# EAGLE design rs422 (EAGLE 9.5.1)
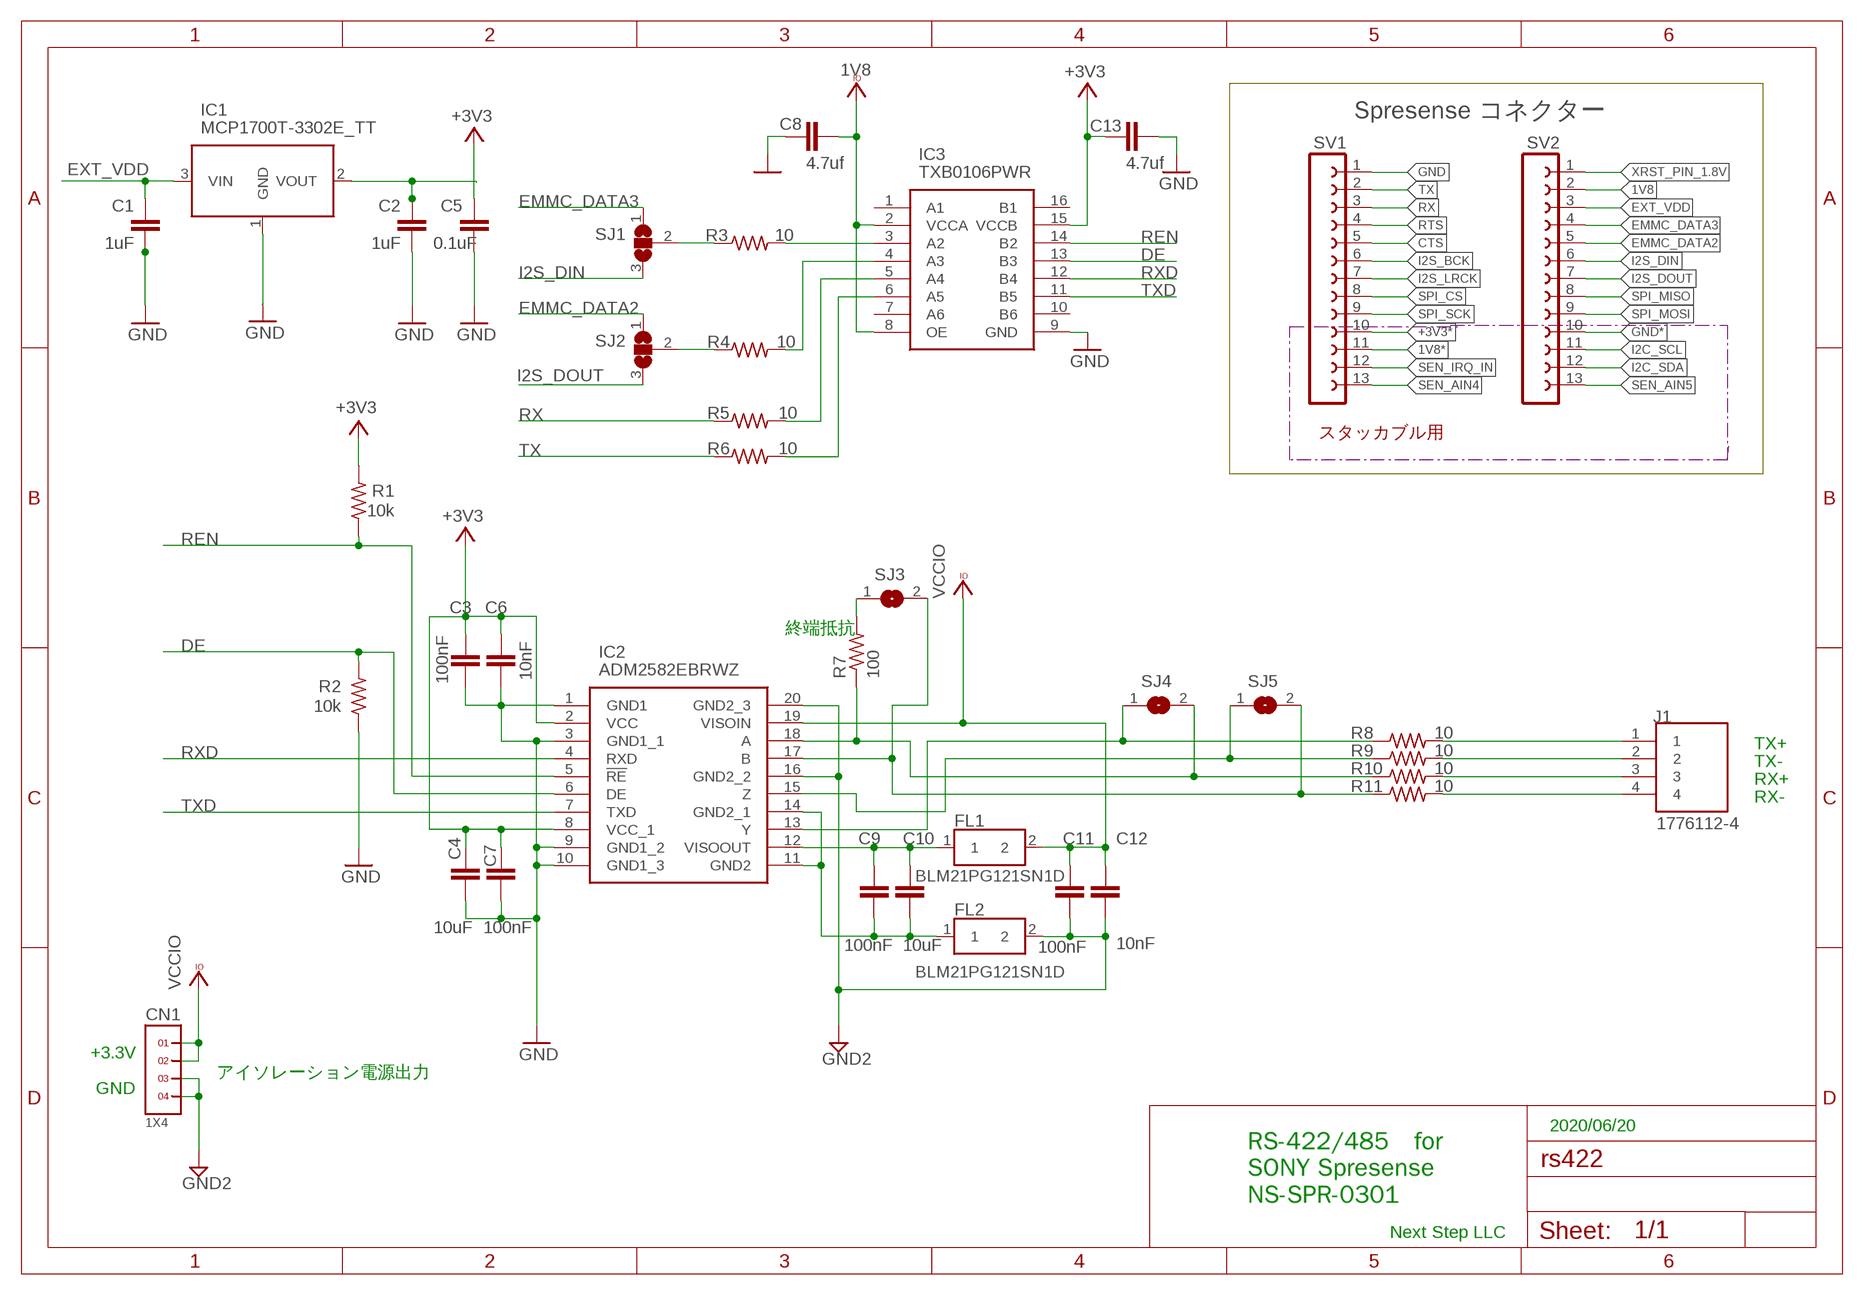
[diagram p0: schematic, sheet 1]

## Parts
C1  1uF  C-EUC0603K  [C0603K]
C2  1uF  C-EUC0603K  [C0603K]
C3  100nF  C-EUC0603K  [C0603K]
C4  10uF  C-EUC0603K  [C0603K]
C5  0.1uF  C-EUC0603K  [C0603K]
C6  10nF  C-EUC0603K  [C0603K]
C7  100nF  C-EUC0603K  [C0603K]
C8  4.7uf  C-EUC0603K  [C0603K]
C9  100nF  C-EUC0603K  [C0603K]
C10  10uF  C-EUC0603K  [C0603K]
C11  100nF  C-EUC0603K  [C0603K]
C12  10nF  C-EUC0603K  [C0603K]
C13  4.7uf  C-EUC0603K  [C0603K]
CN1  1X4  [1X4]
FL1  BLM21PG121SN1D  [BEADC2012X105N]
FL2  BLM21PG121SN1D  [BEADC2012X105N]
IC1  MCP1700T-3302E_TT  [SOT95P237X112-3N]
IC2  ADM2582EBRWZ  [SOIC127P1032X265-20N]
IC3  TXB0106PWR  [SOP65P640X120-16N]
J1  1776112-4  [TE_1776112-4]
R1  10k  R-US_R0603  [R0603]
R2  10k  R-US_R0603  [R0603]
R3  10  R-US_R0603  [R0603]
R4  10  R-US_R0603  [R0603]
R5  10  R-US_R0603  [R0603]
R6  10  R-US_R0603  [R0603]
R7  100  R-US_R0603  [R0603]
R8  10  R-US_R0603  [R0603]
R9  10  R-US_R0603  [R0603]
R10  10  R-US_R0603  [R0603]
R11  10  R-US_R0603  [R0603]
SJ1  SJ2W  [SJ_2]
SJ2  SJ2W  [SJ_2]
SJ3  SJ  [SJ]
SJ4  SJ  [SJ]
SJ5  SJ  [SJ]
SV1  FE13-1  [FE13]
SV2  FE13-1  [FE13]

## Nets
1V8: C8.2 IC3.2(VCCA) IC3.8(OE) SV2.2
1V8*: SV1.11
+3V3: C2.1 C3.1 C4.1 C5.1 C6.1 C7.1 C13.1 IC1.2(VOUT) IC2.2(VCC) IC2.8(VCC_1) IC3.15(VCCB) R1.2
+3V3*: SV1.10
CTS: SV1.5
DE: IC2.6(DE) IC3.13(B3) R2.2
EMMC_DATA2: SJ2.1 SV2.5
EMMC_DATA3: SJ1.1 SV2.4
EXT_VDD: C1.1 IC1.3(VIN) SV2.3
GND: C1.2 C2.2 C3.2 C4.2 C5.2 C6.2 C7.2 C8.1 C13.2 IC1.1(GND) IC2.1(GND1) IC2.3(GND1_1) IC2.9(GND1_2) IC2.10(GND1_3) IC3.9(GND) R2.1 SV1.1
GND2: C11.2 C12.2 CN1.3 CN1.4 FL2.2 IC2.16(GND2_2) IC2.20(GND2_3)
GND*: SV2.10
I2C_SCL: SV2.11
I2C_SDA: SV2.12
I2S_BCK: SV1.6
I2S_DIN: SJ1.3 SV2.6
I2S_DOUT: SJ2.3 SV2.7
I2S_LRCK: SV1.7
N$1: IC2.13(Y) R8.1 SJ4.1
N$2: IC2.15(Z) R9.1 SJ5.1
N$3: IC2.18(A) R7.1 R10.1 SJ4.2
N$4: IC2.17(B) R11.1 SJ3.2 SJ5.2
N$5: C9.1 C10.1 FL1.1 IC2.12(VISOOUT)
N$6: R3.1 SJ1.2
N$7: R7.2 SJ3.1
N$8: IC3.3(A2) R3.2
N$9: IC3.4(A3) R4.2
N$10: IC3.5(A4) R5.2
N$11: C9.2 C10.2 FL2.1 IC2.11(GND2) IC2.14(GND2_1)
N$12: IC3.6(A5) R6.2
N$13: R4.1 SJ2.2
N$27: J1.1 R8.2
N$28: J1.2 R9.2
N$29: J1.3 R10.2
N$30: J1.4 R11.2
REN: IC2.5(!RE) IC3.14(B2) R1.1
RTS: SV1.4
RX: R5.1 SV1.3
RXD: IC2.4(RXD) IC3.12(B4)
SEN_AIN4: SV1.13
SEN_AIN5: SV2.13
SEN_IRQ_IN: SV1.12
SPI_CS: SV1.8
SPI_MISO: SV2.8
SPI_MOSI: SV2.9
SPI_SCK: SV1.9
TX: R6.1 SV1.2
TXD: IC2.7(TXD) IC3.11(B5)
VCCIO: C11.1 C12.1 CN1.1 CN1.2 FL1.2 IC2.19(VISOIN)
XRST_PIN_1.8V: SV2.1
Unconnected: IC3.1(A1) IC3.7(A6) IC3.10(B6) IC3.16(B1)

## Notes on the sheet
- Spresense コネクター
- スタッカブル用
- 終端抵抗
- TX+
- TX-
- RX+
- RX-
- +3.3V
- アイソレーション電源出力
- GND
- 2020/06/20
- RS-422/485　for
  SONY Spresense
  NS-SPR-0301
- Next Step LLC

## Library data of the parts
C1-C13 = rcl:C-EU: CAPACITOR, European symbol; SPICEPREFIX: C
CN1 = headers(2mm)(samtec):1X4
FL1 FL2 = BLM21PG121SN1D:BLM21PG121SN1D: BLM21_N1D Series EMI Suppression Filter 120+/-25% at 100MHz 3A @85 Source: Datasheet <https://componentsearchengine.com/Datasheets/1/BLM21PG121SN1D.pdf>; DESCRIPTION: BLM21_N1D Series EMI Suppression Filter 120+/-25% at 100MHz 3A @85; HEIGHT: 1.05mm; MANUFACTURER_NAME: Murata Electronics; MANUFACTURER_PART_NUMBER: BLM21PG121SN1D; MOUSER_PART_NUMBER: 81-BLM21PG121SN1D; MOUSER_PRICE-STOCK: https://www.mouser.com/Search/Refine.aspx?Keyword=81-BLM21PG121SN1D
IC1 = SamacSys_Parts:MCP1700T-3302E_TT: LDO voltage regulator 250mA Isupply 1uA Source: Datasheet <https://componentsearchengine.com/Datasheets/1/MCP1700T-3302E_TT.pdf>; DESCRIPTION: LDO voltage regulator 250mA Isupply 1uA; HEIGHT: 1.12mm; MANUFACTURER_NAME: Microchip; MANUFACTURER_PART_NUMBER: MCP1700T-3302E/TT; MOUSER_PART_NUMBER: 579-MCP1700T3302E/TT; MOUSER_PRICE-STOCK: https://www.mouser.com/Search/Refine.aspx?Keyword=579-MCP1700T3302E%2FTT
IC2 = SamacSys_Parts:ADM2582EBRWZ: ADM2582EBRWZ, Line Transceiver 16Mbit/s Differential, 3.3 V, 5 V, 20-Pin SOIC W Source: Datasheet <https://componentsearchengine.com/Datasheets/1/ADM2582EBRWZ.pdf>; DESCRIPTION: ADM2582EBRWZ, Line Transceiver 16Mbit/s Differential, 3.3 V, 5 V, 20-Pin SOIC W; HEIGHT: 2.65mm; MANUFACTURER_NAME: Analog Devices; MANUFACTURER_PART_NUMBER: ADM2582EBRWZ; MOUSER_PART_NUMBER: 584-ADM2582EBRWZ; MOUSER_PRICE-STOCK: https://www.mouser.com/Search/Refine.aspx?Keyword=584-ADM2582EBRWZ
IC3 = SamacSys_Parts:TXB0106PWR: 6-Bit Bidirectional Voltage-Level Translator with Auto Direction Sensing and +/-15-kV ESD Protect Source: Datasheet <http://www.ti.com/lit/ds/symlink/txb0106.pdf>; DESCRIPTION: 6-Bit Bidirectional Voltage-Level Translator with Auto Direction Sensing and +/-15-kV ESD Protect; HEIGHT: 1.2mm; MANUFACTURER_NAME: Texas Instruments; MANUFACTURER_PART_NUMBER: TXB0106PWR; MOUSER_PART_NUMBER: 595-TXB0106PWR; MOUSER_PRICE-STOCK: https://www.mouser.com/Search/Refine.aspx?Keyword=595-TXB0106PWR
J1 = 1776112-4:1776112-4; AVAILABILITY: Unavailable; COMMENT: 1776112-4; DESCRIPTION: Buchanan Series 4 Position AWG 16-28 Black PCB Through Hole Terminal Block; MF: TE Connectivity; MP: 1776112-4; PACKAGE: None; PRICE: None; TE_PURCHASE_URL: https://www.te.com/usa-en/product-1776112-4.html?te_bu=Cor&te_type=disp&te_campaign=seda_glo_cor-seda-global-disp-prtnr-fy19-seda-model-bom-cta_sma-317_1&elqCampaignId=32493
R1-R11 = rcl:R-US_: RESISTOR, American symbol; SPICEPREFIX: R
SJ1 SJ2 = jumper:SJ2W: SMD solder JUMPER
SJ3-SJ5 = jumper:SJ: SMD solder JUMPER
SV1 SV2 = con-lsta:FE13-1: FEMALE HEADER; OC_FARNELL: unknown; OC_NEWARK: unknown

## Board
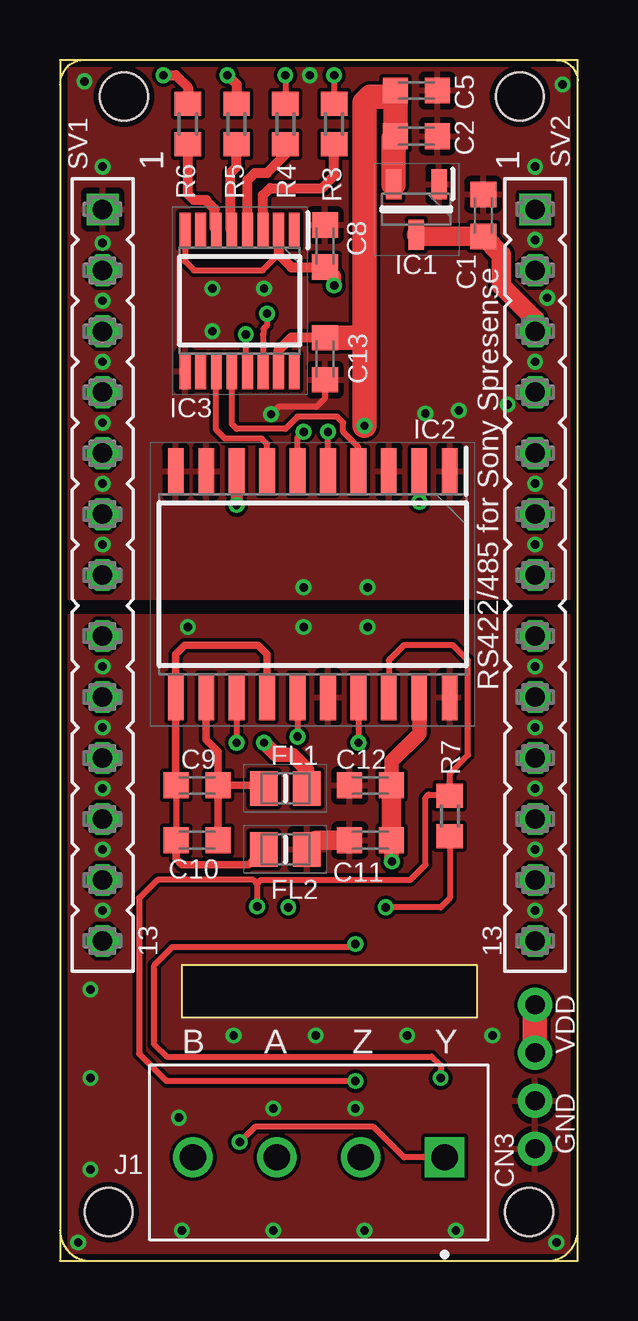
[diagram p1: board, top side]
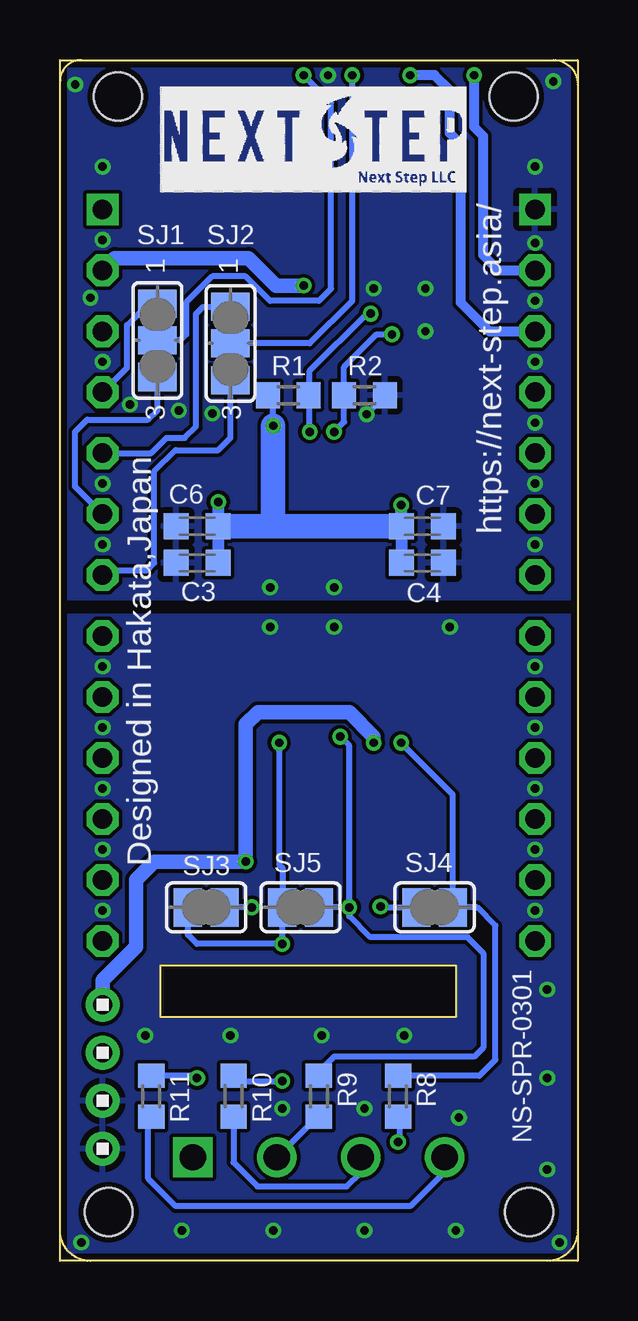
[diagram p2: board, bottom side, seen from below]

Size 21.59 x 50.04 mm. Coordinates in mm from the lower left corner, seen from the top.
Outline: 0,0 21.59,0 21.59,50.04 0,50.04 0,0
Copper layers (1*16): Top 0.035mm / dielectric 1.5mm / Bottom 0.035mm
Design rules "SeeedStudio_2layer_DRU_no_angle_20140221": minimum track width 6mil, minimum drill 12mil, track to track 6mil, track to pad 6mil, pad to pad 6mil, via to via 6mil, smd to smd 0mil, copper to edge 10mil, drill to drill 10mil, minimum pad ring 10mil, minimum via ring 6mil, stop-mask expansion 2mil, vias tented up to drill 100mil, thermal gap 10mil
Holes 2 mm at 2.67,48.51 19.18,48.51 2.03,2.03 19.56,2.03
tRestrict: 4 lines
bRestrict: 4 lines
Milling: 9 lines

### Footprints (pad centres in the part's own frame; a part is rotated, then mirrored left to right if it is on the bottom)
C0603K = smd 1.05 x 1.08: 1 -0.875,0; 2 0.875,0
1X4 = drill 0.8 pad 1.422: 1 0,0; 2 2,0; 3 4,0; 4 6,0
BEADC2012X105N = smd 1.15 x 1.45: 1 -0.9,0; 2 0.9,0
SOT95P237X112-3N = smd 1.25 x 0.65: 1 -1.05,0.95; 2 -1.05,-0.95; 3 1.05,0
SOIC127P1032X265-20N = smd 1.925 x 0.65: 1 -4.712,5.715; 2 -4.712,4.445; 3 -4.712,3.175; 4 -4.712,1.905; 5 -4.712,0.635; 6 -4.712,-0.635; 7 -4.712,-1.905; 8 -4.712,-3.175; 9 -4.712,-4.445; 10 -4.712,-5.715; 11 4.712,-5.715; 12 4.712,-4.445; 13 4.712,-3.175; 14 4.712,-1.905; 15 4.712,-0.635; 16 4.712,0.635; 17 4.712,1.905; 18 4.712,3.175; 19 4.712,4.445; 20 4.712,5.715
SOP65P640X120-16N = smd 1.475 x 0.45: 1 -2.938,2.275; 2 -2.938,1.625; 3 -2.938,0.975; 4 -2.938,0.325; 5 -2.938,-0.325; 6 -2.938,-0.975; 7 -2.938,-1.625; 8 -2.938,-2.275; 9 2.938,-2.275; 10 2.938,-1.625; 11 2.938,-0.975; 12 2.938,-0.325; 13 2.938,0.325; 14 2.938,0.975; 15 2.938,1.625; 16 2.938,2.275
TE_1776112-4 = drill 1.1 square: 1 -5.25,0 | drill 1.1: 2 -1.75,0; 3 1.75,0; 4 5.25,0
R0603 = smd 1 x 1.1: 1 -0.85,0; 2 0.85,0
SJ_2 = smd 1.168 x 1.6: 1 -1.524,0; 2 0,0; 3 1.524,0
SJ = smd 1.168 x 1.6: 1 -0.762,0; 2 0.762,0
FE13 = drill 0.813 square: 1 -15.24,0 | drill 0.813 octagon: 2 -12.7,0; 3 -10.16,0; 4 -7.62,0; 5 -5.08,0; 6 -2.54,0; 7 0,0; 8 2.54,0; 9 5.08,0; 10 7.62,0; 11 10.16,0; 12 12.7,0; 13 15.24,0

### Placement (x,y rotation side)
C1  17.65,43.56 90 top
C2  14.86,46.86 0 top
C3  15.88,29.08 180 bottom
C4  6.48,29.08 0 bottom
C5  14.86,48.77 0 top
C6  15.88,30.61 180 bottom
C7  6.48,30.61 0 bottom
C8  11.05,42.29 270 top
C9  5.71,19.81 180 top
C10  5.71,17.53 180 top
C11  12.95,17.53 180 top
C12  12.95,19.81 180 top
C13  11.05,37.59 270 top
CN1  19.81,10.67 270 bottom
FL1  9.4,19.68 0 top
FL2  9.4,17.14 0 top
IC1  14.86,43.82 270 top
IC2  10.54,28.19 270 top
IC3  7.49,40.01 270 top
J1  10.79,4.32 180 top
R1  12.06,36.07 180 bottom
R2  8.89,36.07 180 bottom
R3  11.43,47.37 270 top
R4  9.4,47.37 270 top
R5  7.37,47.37 270 top
R6  5.33,47.37 270 top
R7  16.26,18.54 270 top
R8  7.49,6.86 270 bottom
R9  10.79,6.86 270 bottom
R10  14.35,6.86 270 bottom
R11  17.78,6.86 270 bottom
SJ1  17.53,38.35 270 bottom
SJ2  14.48,38.23 270 bottom
SJ3  15.49,14.73 180 bottom
SJ4  5.97,14.73 180 bottom
SJ5  11.56,14.73 180 bottom
SV1  1.78,28.57 270 top
SV2  19.81,28.57 270 top

### Tracks (layer width: path | path; a pad name or v marks a point on that pad's centre or on a via)
1V8  (via drill 0.35)
  Top 0.254: IC3.8 5.22,41.64 5.59,41.27 8.46,41.27 9.12,41.94
  Top 0.406: IC3.2 9.12,41.94 9.65,41.4 11.04,41.4 C8.2
  Top 0.61: C8.2 11.43,41.03 v11.43,40.64
  Bottom 0.61: v11.43,40.64 12.57,40.64 13.72,41.78 19.3,41.78 SV2.2
+3V3  (via drill 0.35)
  Top 0.406: IC3.15 9.12,37.95 9.65,38.48 11.04,38.48 C13.1
  Top 0.508: IC2.8 v7.37,31.5 | IC2.2 v14.99,31.62
  Top 0.61: 13.91,46.79 C2.1
  Top 1.016: C2.1 C5.1 13.73,48.51 12.95,48.51 12.7,48.26 12.7,38.73 | IC1.2 13.91,46.79 | 12.7,38.73 v12.7,34.8 | C13.1 12.43,38.47 12.7,38.73
  Bottom 0.254: v12.7,34.8 12.7,35.85 R1.2
  Bottom 0.508: v14.99,31.62 14.99,30.62 C6.1 C3.1 | v7.37,31.5 7.37,30.62 C7.1 C4.1
  Bottom 1.016: v12.7,34.8 12.7,30.61 | 12.7,30.61 14.97,30.61 14.99,30.62 | C7.1 12.7,30.61
DE  (via drill 0.35)
  Top 0.254: IC2.6 9.91,34.29 v10.16,34.54 | v7.75,38.61 7.75,37.14 IC3.13
  Bottom 0.254: v10.16,34.54 9.74,34.96 R2.2 9.74,37.25 8.38,38.61 v7.75,38.61
EMMC_DATA2
  Bottom 0.254: SV2.5 17.78,33.65 17.15,34.29 16.38,34.29 15.91,34.76 15.91,39.46 15.62,39.75 SJ2.1
EMMC_DATA3
  Bottom 0.254: SV2.4 18.8,37.21 18.8,38.99 17.91,39.88 SJ1.1
EXT_VDD
  Top 0.61: SV2.3 19.81,39.24
  Top 0.813: IC1.3 14.94,42.69 C1.1 18.42,41.92 18.42,40.64 19.81,39.24
GND  (via drill 0.35)
  Top 0.254: C13.2 11.05,35.94 10.69,35.59 9.11,35.59 v8.8,35.28
  Bottom 0.254: v8.8,35.28 8.04,36.04 R2.1
  other vias: 1.02,49.15 20.96,49.02 1.78,45.59 1.78,42.42 1.78,37.47 1.78,40.01 1.78,34.93 1.78,32.39 1.78,29.84 20.32,40.13 19.81,45.59 19.81,42.55 19.81,37.47 19.81,32.39 19.81,29.84 6.35,40.51 8.51,40.51 6.35,38.73 10.16,28.07 12.83,28.07 10.41,49.4 16.64,35.43 15.24,35.31 18.67,35.69
  pour Top: 0,50.04 21.59,50.04 21.59,27.56 0,27.56
  pour Bottom: 0,50.04 21.59,50.04 21.59,27.56 0,27.56
GND2  (via drill 0.35)
  Top 0.813: FL2.2 10.68,17.53 C11.2
  other vias: 1.78,24.77 1.78,22.22 1.78,19.68 1.78,17.14 1.78,14.6 1.27,11.3 1.27,7.62 1.27,3.81 0.76,0.76 5.08,1.27 8.89,1.27 12.7,1.27 16.51,1.27 20.7,0.76 19.81,14.6 19.81,17.14 19.81,19.68 19.81,22.22 19.81,24.77 5.33,26.42 10.16,26.42 12.83,26.42 4.95,5.97 8.89,6.35 12.32,6.35 10.67,9.4 14.48,9.4 18.03,9.4 7.24,9.4
  pour Top: 0,26.92 21.59,26.92 21.59,0 0,0
  pour Bottom: 0,26.92 21.59,26.92 21.59,0 0.13,0 0,-0.13
I2S_DIN
  Bottom 0.254: SV2.6 20.96,32.26 20.96,34.54 20.45,35.05 17.91,35.05 17.53,35.43 SJ1.3
I2S_DOUT
  Bottom 0.254: SV2.7 19.62,28.77 17.97,28.77 17.65,29.08 17.65,32.89 16.76,33.78 14.99,33.78 14.48,34.29 SJ2.3
N$1  (via drill 0.35)
  Top 0.254: IC2.13 v7.37,21.59
  Bottom 0.254: R8.1 4.1,7.71 3.43,8.38 3.43,13.97 4.19,14.73 SJ4.1 5.21,19.43 v7.37,21.59
N$2  (via drill 0.35)
  Top 0.254: IC2.15 v9.91,21.84
  Bottom 0.254: v9.53,14.73 9.53,14.35 8.66,13.49 4.6,13.49 3.94,12.83 3.94,8.89 4.32,8.51 10.16,8.51 10.8,7.87 R9.1 | v9.53,14.73 9.53,21.46 v9.91,21.84 | v9.53,14.73 SJ5.1
N$3  (via drill 0.35)
  Top 0.254: IC2.18 13.72,25.02 14.35,25.65 16.38,25.65 17.02,25.02 17.02,21.08 16.26,20.32 R7.1 16.22,19.43 15.37,19.43 15.24,19.3 15.24,16.51 14.61,15.87 8.38,15.87 8.22,15.72 | v12.32,7.49 4.45,7.49 3.3,8.64 3.3,15.11 4.06,15.87 8.06,15.87 8.22,15.72 | 8.22,15.72 v8.22,14.76
  Bottom 0.254: R10.1 14.14,7.49 v12.32,7.49 | v8.22,14.76 8.19,14.73 SJ4.2
N$4  (via drill 0.35)
  Top 0.254: IC2.17 v12.45,21.59 | v15.88,7.62 15.88,8.13 15.49,8.51 4.45,8.51 3.94,9.02 3.94,12.32 4.7,13.08 12.19,13.08 v12.32,13.21
  Bottom 0.254: v15.88,7.62 15.96,7.71 R11.1 | v12.45,21.59 12.45,16.51 12.32,16.38 SJ5.2 v12.32,13.21 15.88,13.21 16.26,13.59 SJ3.2
N$5
  Top 0.305: C9.1 C10.1 | IC2.12 6.1,21.72 6.6,21.21 6.6,19.83 C9.1 | C9.1 8.37,19.81 FL1.1
N$6  (via drill 0.35)
  Top 0.254: v11.43,49.4 R3.1
  Bottom 0.254: v11.43,49.4 10.29,48.26 10.29,40.51 10.8,40 12.83,40 13.84,41.02 15.24,41.02 16.32,39.94 16.32,38.61 16.57,38.35 SJ1.2
N$7  (via drill 0.35)
  Top 0.254: R7.2 16.26,15.11 15.88,14.73 v13.59,14.73
  Bottom 0.254: v13.59,14.73 SJ3.1
N$8
  Top 0.406: IC3.3 8.47,44.41 8.76,44.7 10.92,44.7 11.43,45.21 R3.2
N$9
  Top 0.406: IC3.4 7.82,45.03 8.13,45.34 8.64,45.34 9.4,46.1 R4.2
N$10
  Top 0.406: IC3.5 7.11,43 7.11,45.34 7.37,45.59 R5.2
N$11
  Top 0.254: C9.2 C10.2
  Top 0.305: C9.2 4.83,19.83 IC2.11 4.83,25.27 5.21,25.65 8.26,25.65 8.64,25.27 IC2.14 | C10.2 4.84,16.75 5.08,16.51 7.86,16.51 FL2.1
N$12
  Top 0.406: IC3.6 6.45,43.01 6.45,43.83 6.1,44.18 6.1,44.2 5.59,44.2 5.33,44.45 R6.2
N$13  (via drill 0.35)
  Top 0.254: v9.4,49.4 R4.1
  Bottom 0.254: v9.4,49.4 9.4,40 11.18,38.23 SJ2.2
N$27  (via drill 0.35)
  Top 0.254: J1.1 14.35,4.32 13.08,5.59 8.13,5.59 v7.49,4.95
  Bottom 0.254: R8.2 7.41,5.92 7.41,5.04 v7.49,4.95
N$28
  Bottom 0.254: J1.2 10.86,6.01 R9.2
N$29
  Bottom 0.254: R10.2 14.35,4.1 13.35,3.1 9.62,3.1 9.05,3.68 J1.3
N$30
  Bottom 0.254: R11.2 17.65,6.01 17.91,5.75 17.91,3.43 16.76,2.29 6.99,2.29 5.59,3.68 5.59,4.27 J1.4
REN  (via drill 0.35)
  Top 0.254: IC2.5 v11.18,34.54 | v8.64,39.47 8.64,38.99 8.48,38.83 8.48,38.61 8.47,38.6 IC3.14
  Bottom 0.254: v11.18,34.54 11.18,36.03 R1.1 11.18,36.11 11.18,37.08 8.79,39.47 v8.64,39.47
RX  (via drill 0.35)
  Top 0.406: v6.99,49.4 7.37,49.02 R5.1
  Bottom 0.406: v6.99,49.4 5.97,49.4 5.33,48.77 5.33,46.99 4.88,46.53 4.88,39.93 3.68,38.73 SV1.3
RXD
  Top 0.254: IC2.4 12.45,33.91 11.81,34.54 11.81,34.92 11.56,35.18 9.91,35.18 9.4,34.67 7.37,34.67 7.17,34.87 IC3.12
TX  (via drill 0.35)
  Top 0.406: v4.32,49.4 4.83,49.4 5.33,48.89 R6.1
  Bottom 0.406: v4.32,49.4 4.32,47.24 3.94,46.86 3.94,41.91 3.3,41.27 SV1.2
TXD
  Top 0.254: IC2.7 8.64,34.04 8.41,34.26 6.88,34.26 6.52,34.63 IC3.11
VCCIO  (via drill 0.35)
  Top 0.61: IC2.19 14.99,21.97 13.83,20.81 C12.1 | v13.84,16.64 13.83,16.65 C11.1 | v8.51,21.59 9.02,21.08 9.69,21.08 10.3,20.47 FL1.2
  Top 0.813: C12.1 C11.1
  Top 1.016: CN1.1 CN1.2
  Bottom 0.61: CN1.1 19.81,11.68 18.42,13.08 18.42,15.87 17.65,16.64 v13.84,16.64 13.84,22.35 13.34,22.86 9.53,22.86 8.51,21.84 v8.51,21.59

### Text on the board
tPlace: 1 | 1 | RS422/485 for Sony Spresense | 13 | 13 | B | A | Z | Y | VDD | GND | CN3
bPlace: https://next-step.asia/ | 1 | 1 | 3 | 3 | Designed in Hakata,Japan | NS-SPR-0301